# EAGLE design MOwlEye (EAGLE 7.5.0)
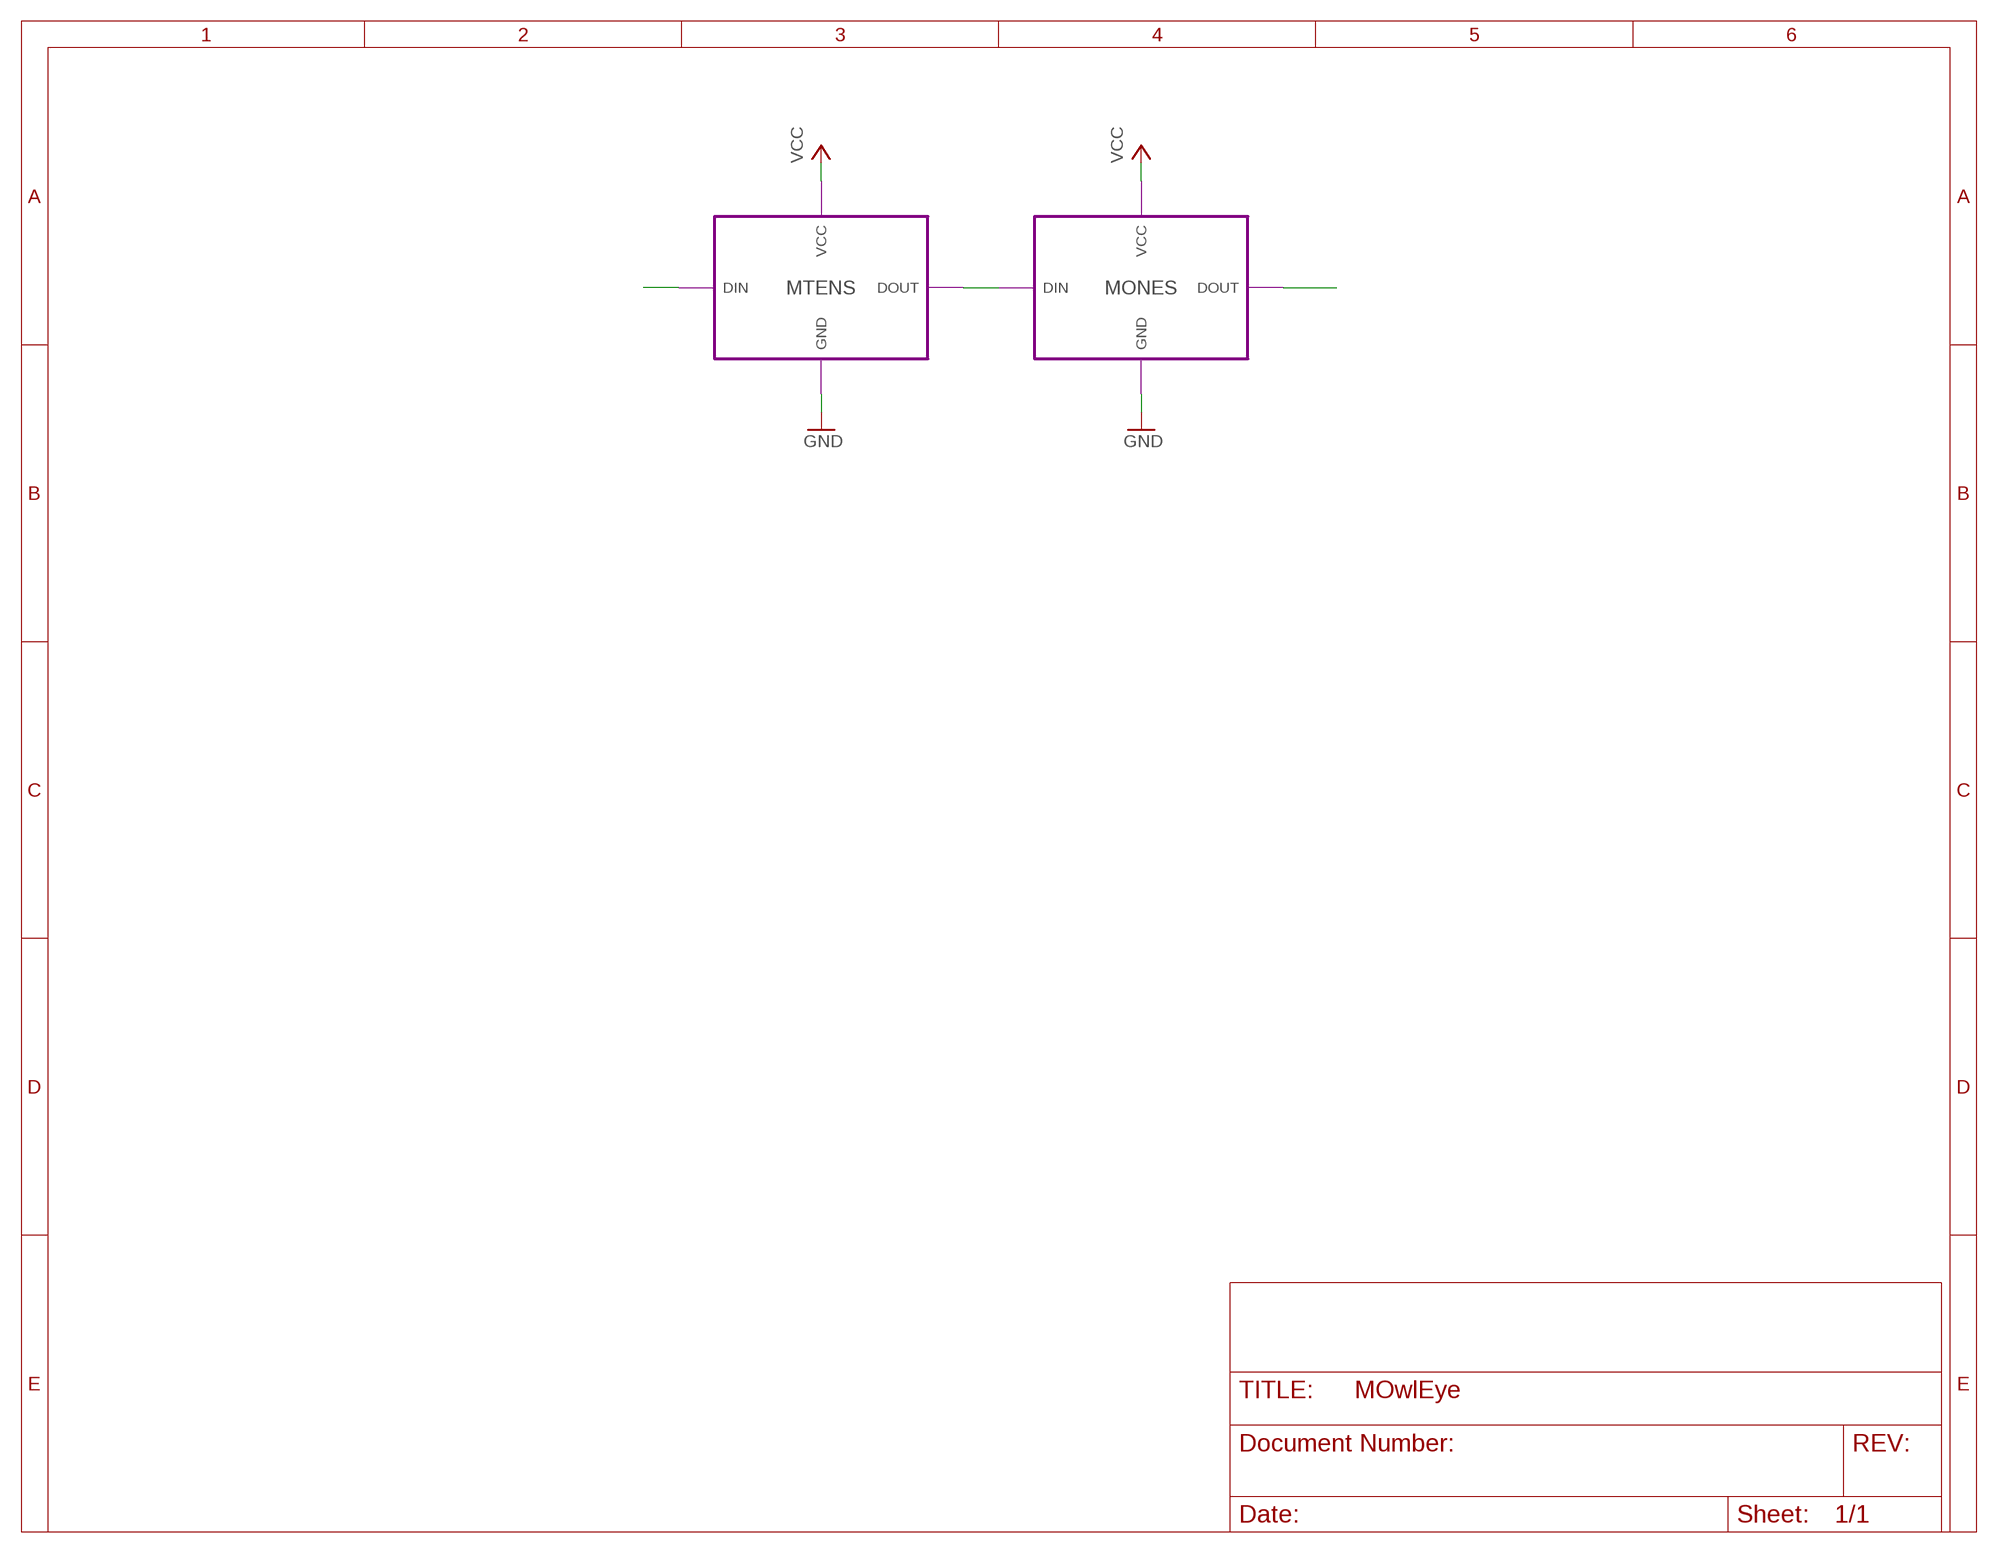
[diagram p0: schematic, sheet 1]

## Module instances
MTENS = LEDS
MONES = LEDS

## Nets
GND: port MTENS.GND MONES.GND
N$1: port MTENS.DOUT MONES.DIN
N$2: port MTENS.DIN
N$3: port MONES.DOUT
VCC: port MTENS.VCC MONES.VCC

## Library data of the parts

## Module LEDS
Ports: GND(pwr) VCC(pwr) DOUT(out) DIN(in)
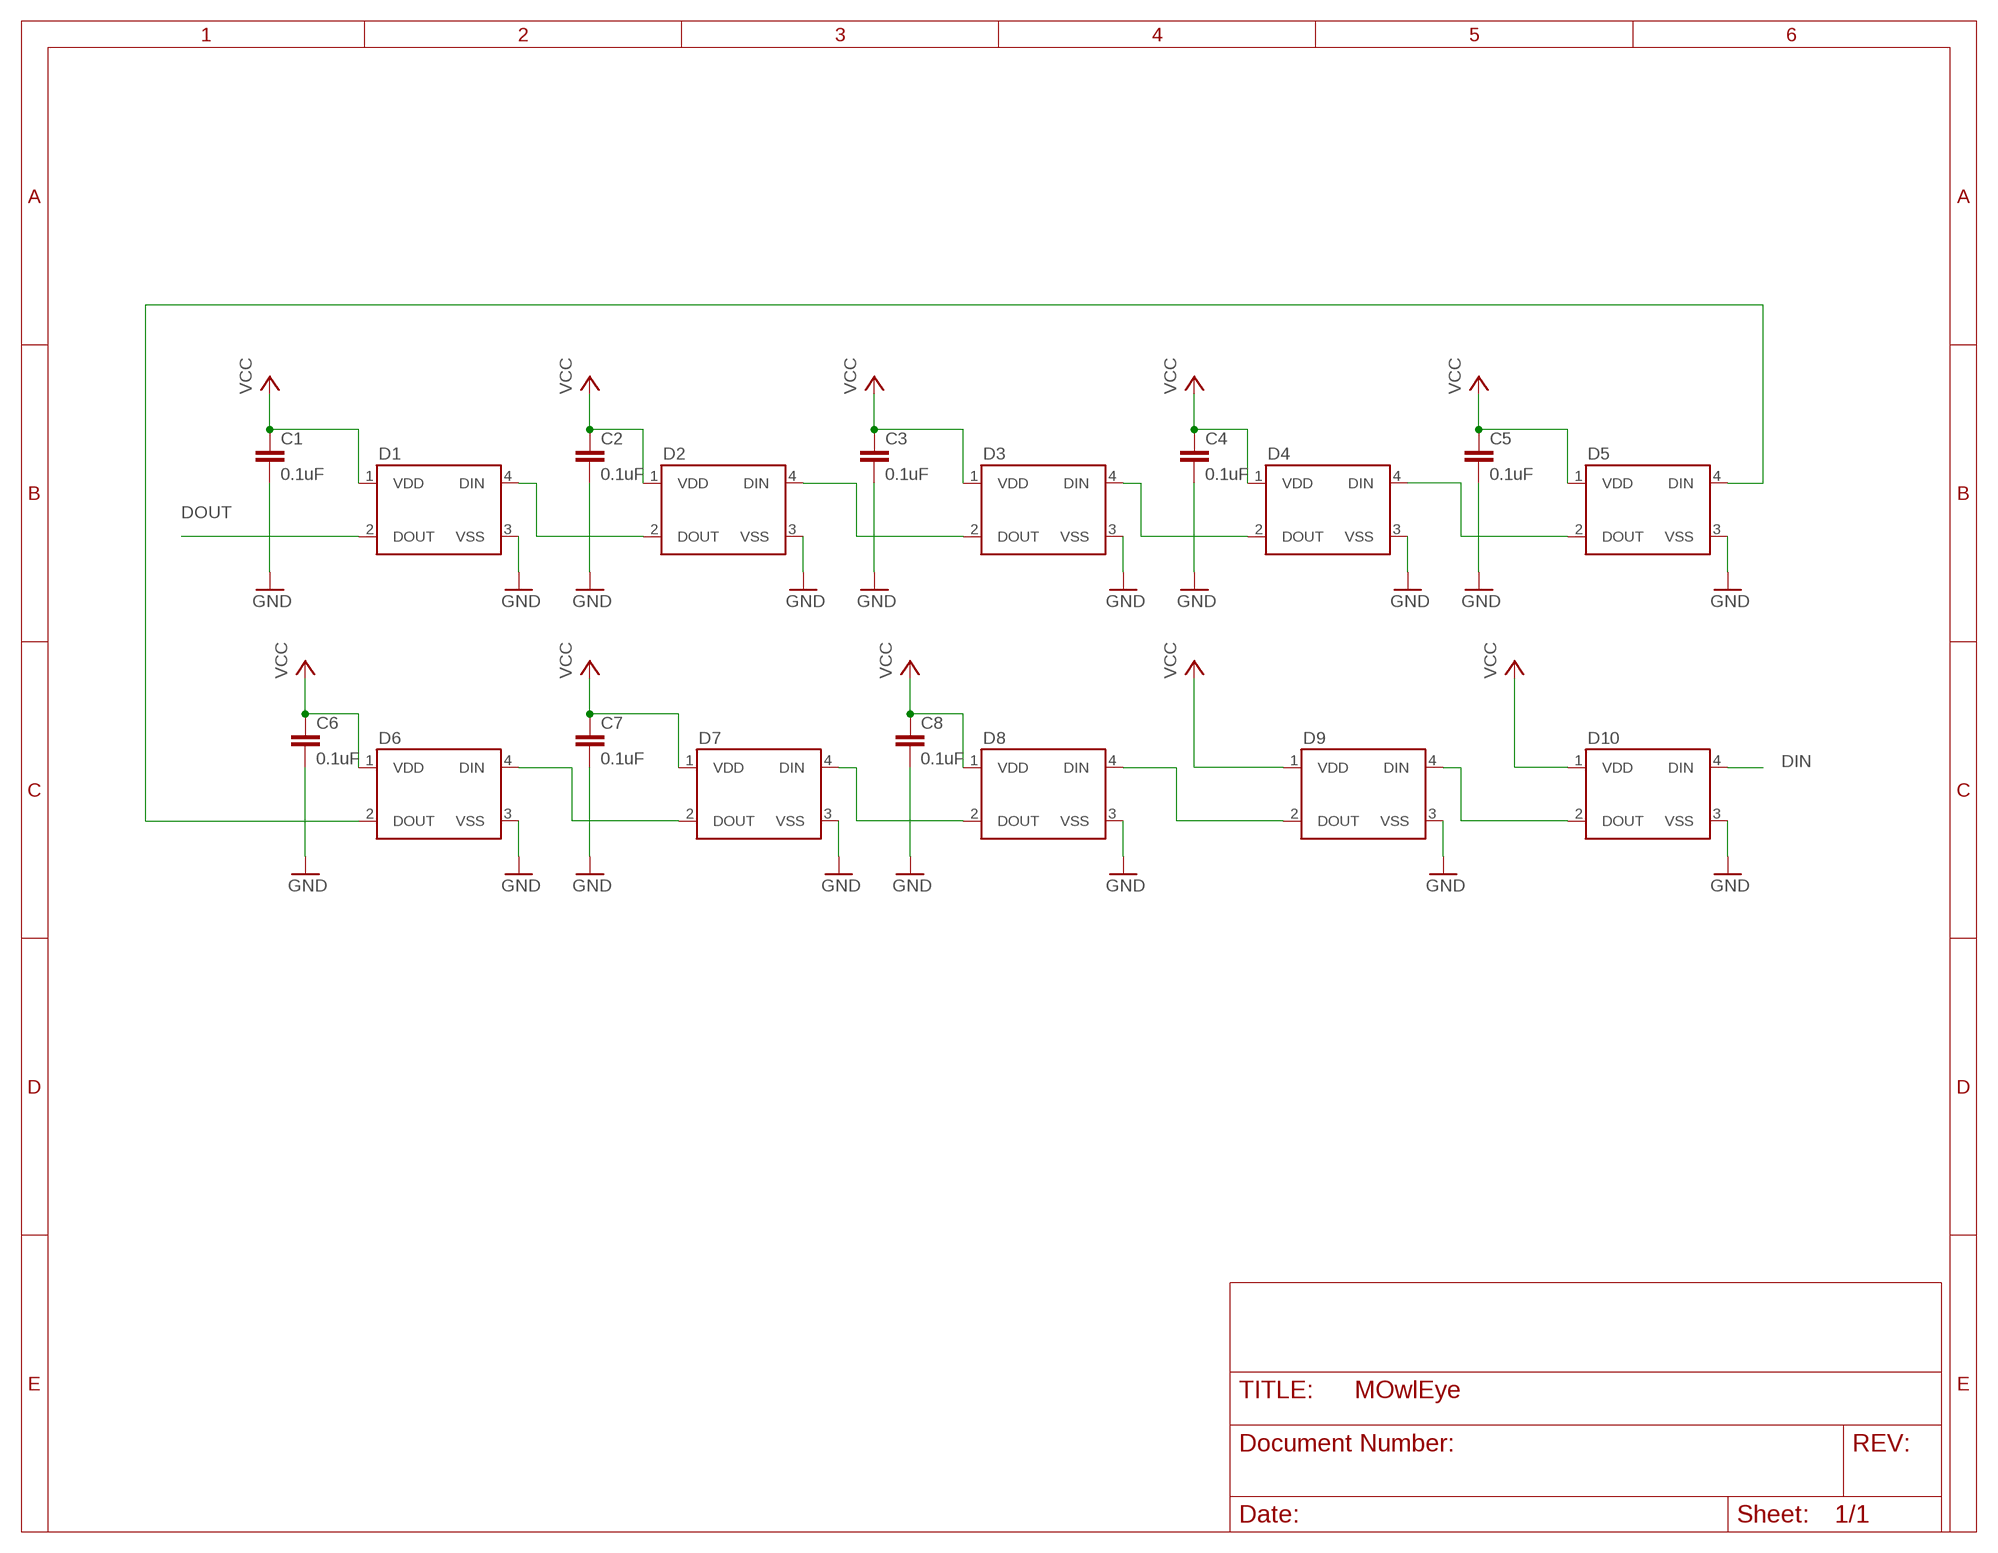
[diagram p1: schematic, module LEDS, sheet 1]

### Parts
C1  0.1uF  0.1UF-25V(+80/-20%)(0603)  [0603-CAP]
C2  0.1uF  0.1UF-25V(+80/-20%)(0603)  [0603-CAP]
C3  0.1uF  0.1UF-25V(+80/-20%)(0603)  [0603-CAP]
C4  0.1uF  0.1UF-25V(+80/-20%)(0603)  [0603-CAP]
C5  0.1uF  0.1UF-25V(+80/-20%)(0603)  [0603-CAP]
C6  0.1uF  0.1UF-25V(+80/-20%)(0603)  [0603-CAP]
C7  0.1uF  0.1UF-25V(+80/-20%)(0603)  [0603-CAP]
C8  0.1uF  0.1UF-25V(+80/-20%)(0603)  [0603-CAP]
D1  WS2812B  [WS2812B]
D2  WS2812B  [WS2812B]
D3  WS2812B  [WS2812B]
D4  WS2812B  [WS2812B]
D5  WS2812B  [WS2812B]
D6  WS2812B  [WS2812B]
D7  WS2812B  [WS2812B]
D8  WS2812B  [WS2812B]
D9  WS2812B  [WS2812B]
D10  WS2812B  [WS2812B]

### Nets
DIN: D10.4(DIN)
DOUT: D1.2(DOUT)
GND: C1.2 C2.2 C3.2 C4.2 C5.2 C6.2 C7.2 C8.2 D1.3(VSS) D2.3(VSS) D3.3(VSS) D4.3(VSS) D5.3(VSS) D6.3(VSS) D7.3(VSS) D8.3(VSS) D9.3(VSS) D10.3(VSS)
N$1: D2.4(DIN) D3.2(DOUT)
N$5: D1.4(DIN) D2.2(DOUT)
N$6: D3.4(DIN) D4.2(DOUT)
N$7: D4.4(DIN) D5.2(DOUT)
N$9: D5.4(DIN) D6.2(DOUT)
N$10: D6.4(DIN) D7.2(DOUT)
N$12: D7.4(DIN) D8.2(DOUT)
N$13: D8.4(DIN) D9.2(DOUT)
N$15: D9.4(DIN) D10.2(DOUT)
VCC: C1.1 C2.1 C3.1 C4.1 C5.1 C6.1 C7.1 C8.1 D1.1(VDD) D2.1(VDD) D3.1(VDD) D4.1(VDD) D5.1(VDD) D6.1(VDD) D7.1(VDD) D8.1(VDD) D9.1(VDD) D10.1(VDD)

### Library data of the parts
C1-C8 = SparkFun-Capacitors:0.1UF-25V(+80/-20%)(0603): CAP-00810 Ceramic Standard decoupling cap; PROD_ID: CAP-00810
D1-D10 = SparkFun-LED:WS2812B: WS2812B - Intelligent control LED integrated light source Technical Specifications: Power Supply Voltage (VDD): 3.5 to 5.3 V Input Voltage (VI): -0.5 to VDD+0.5 V Operating Junction Temperature (Topt): -25°C to +80°C Storage Temperature Range (Tstg): -55°C to +150°C

## Board
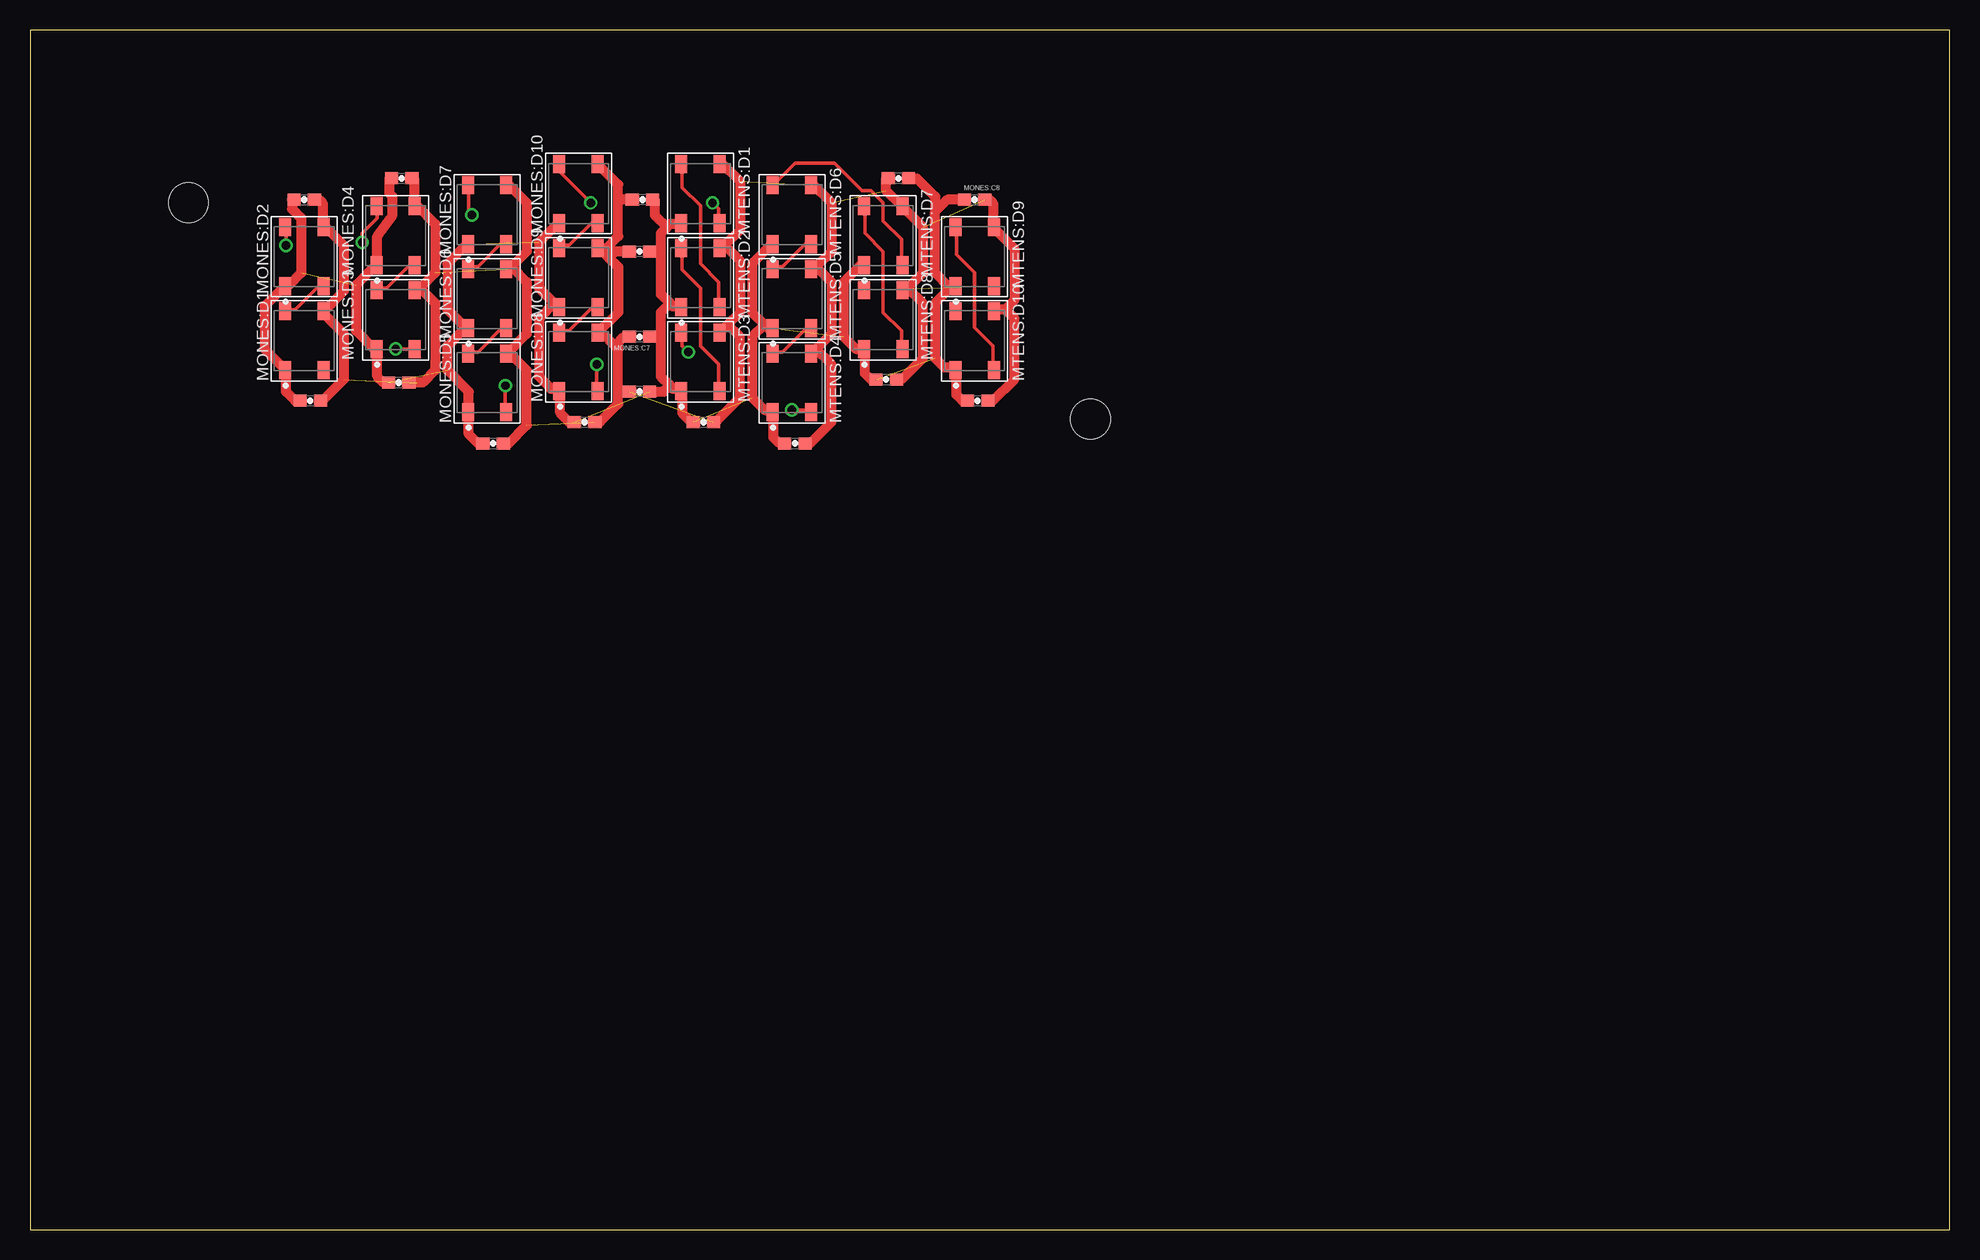
[diagram p2: board, top side]
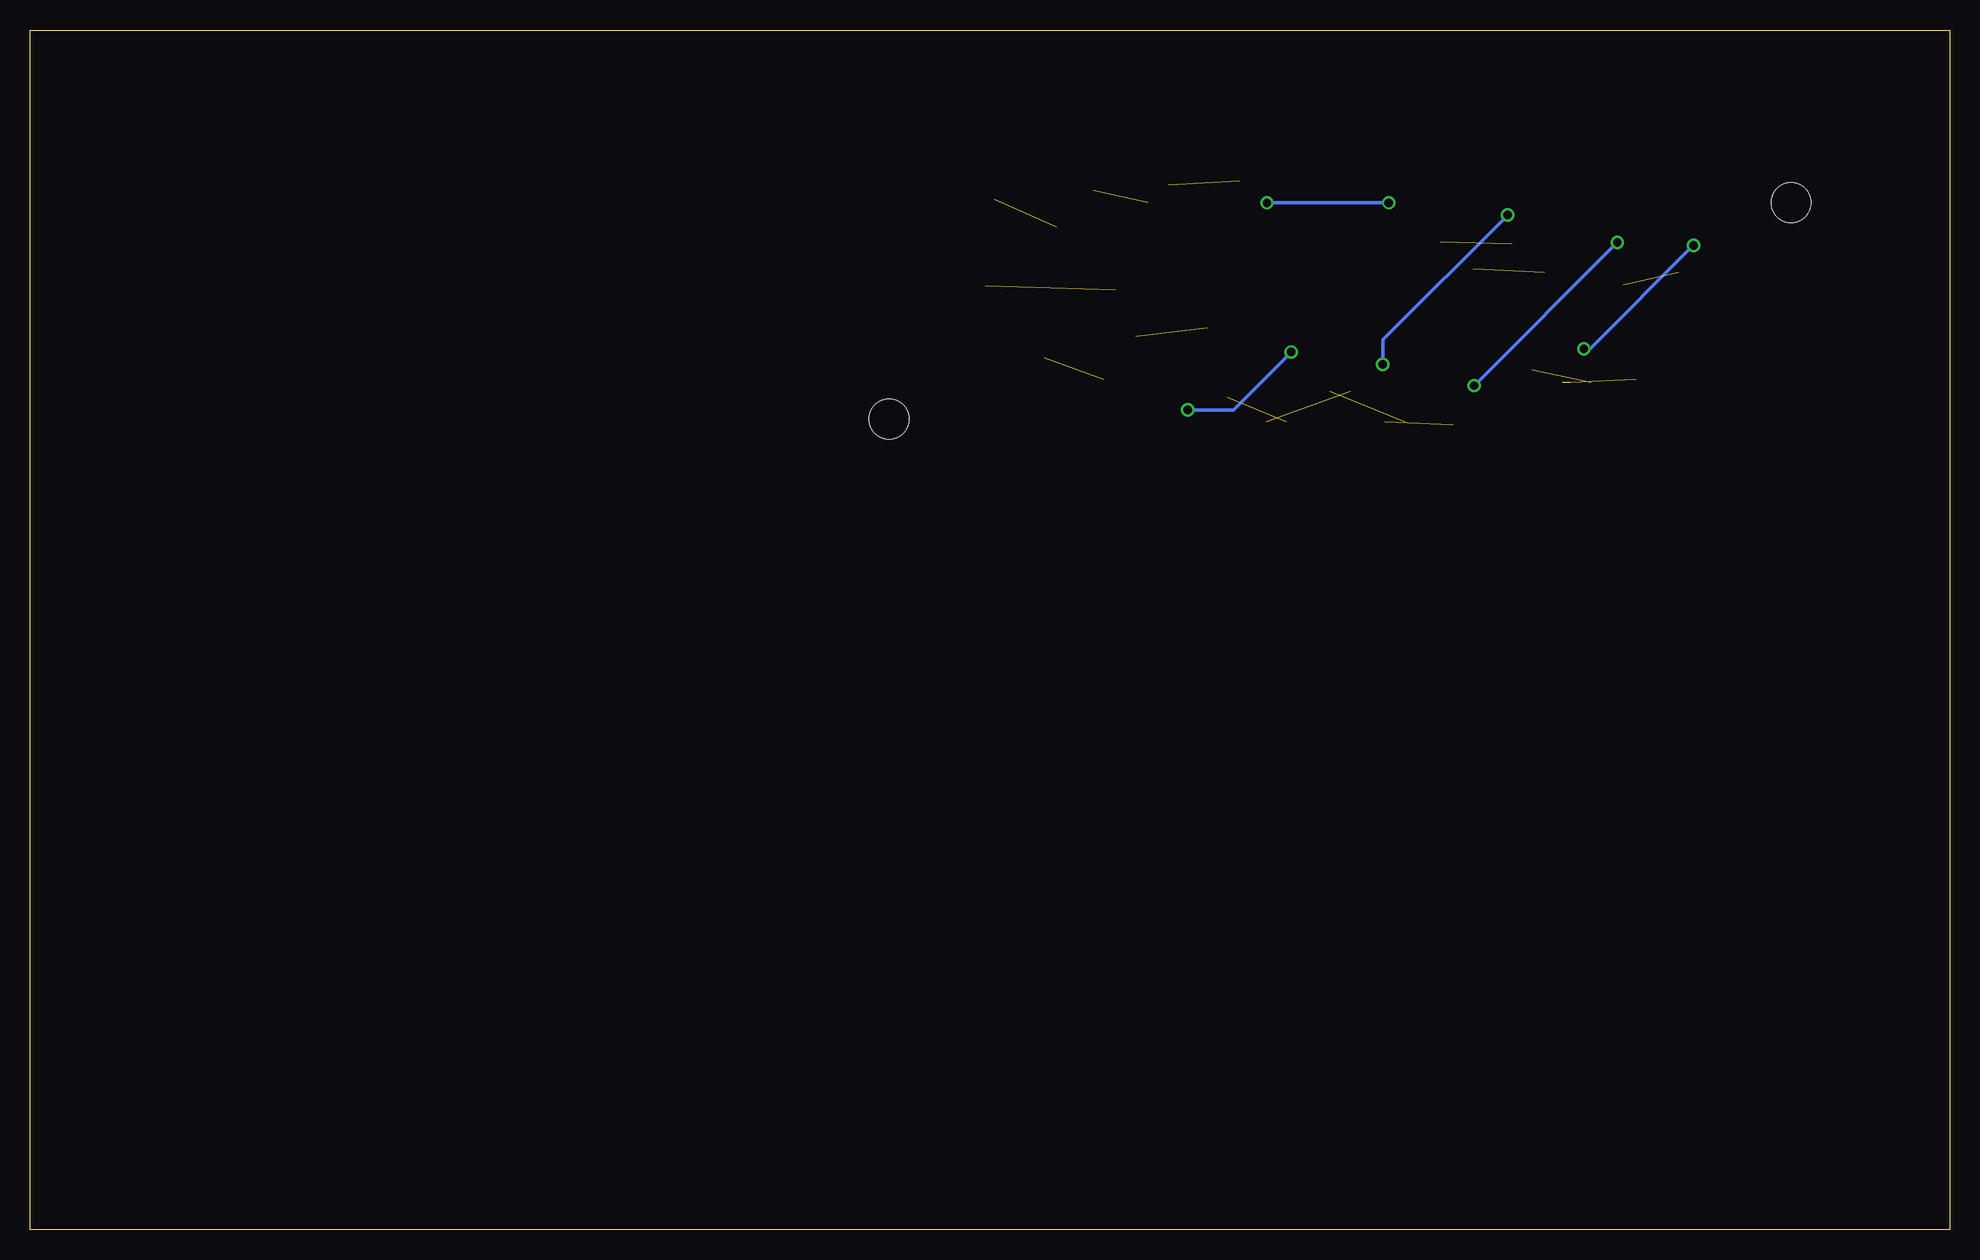
[diagram p3: board, bottom side, seen from below]

Size 160 x 100 mm. Coordinates in mm from the lower left corner, seen from the top.
Outline: 0,0 160,0 160,100 0,100 0,0
Copper layers (1*16): Top 0.035mm / dielectric 1.5mm / Bottom 0.035mm
Design rules "default": minimum track width 10mil, minimum drill 24mil, track to track 8mil, track to pad 8mil, pad to pad 8mil, via to via 8mil, smd to smd 8mil, copper to edge 40mil, drill to drill 8mil, minimum pad ring 10mil, minimum via ring 8mil, stop-mask expansion 4mil, vias tented up to drill 0mil, thermal gap 10mil

### Footprints (pad centres in the part's own frame; a part is rotated, then mirrored left to right if it is on the bottom)
0603-CAP = smd 1.1 x 1: 1 -0.85,0; 2 0.85,0
WS2812B = smd 1.5 x 1: 1 -2.45,1.6; 2 -2.45,-1.6; 3 2.45,-1.6; 4 2.45,1.6
STAND-OFF = hole 3.302: 0,0

### Placement (x,y rotation side)
MONES:C1  0.1uF  [0603-CAP]  23.37,69.09 0 top
MONES:C2  0.1uF  [0603-CAP]  30.73,70.61 0 top
MONES:C3  0.1uF  [0603-CAP]  38.61,65.53 0 top
MONES:C4  0.1uF  [0603-CAP]  46.23,67.31 0 top
MONES:C5  0.1uF  [0603-CAP]  22.86,85.85 0 top
MONES:C6  0.1uF  [0603-CAP]  30.99,87.63 0 top
MONES:C7  0.1uF  [0603-CAP]  50.8,74.42 180 top
MONES:C8  0.1uF  [0603-CAP]  78.74,85.85 0 top
MONES:D1  [WS2812B]  22.86,74.09 90 top
MONES:D2  [WS2812B]  22.86,81.1 90 top
MONES:D3  [WS2812B]  30.48,75.84 90 top
MONES:D4  [WS2812B]  30.48,82.85 90 top
MONES:D5  [WS2812B]  38.1,70.59 90 top
MONES:D6  [WS2812B]  38.1,77.6 90 top
MONES:D7  [WS2812B]  38.1,84.61 90 top
MONES:D8  [WS2812B]  45.72,72.34 90 top
MONES:D9  [WS2812B]  45.72,79.35 90 top
MONES:D10  [WS2812B]  45.72,86.36 90 top
MTENS:C1  0.1uF  [0603-CAP]  51.05,85.85 180 top
MTENS:C2  0.1uF  [0603-CAP]  50.8,81.53 180 top
MTENS:C3  0.1uF  [0603-CAP]  50.8,69.85 180 top
MTENS:C4  0.1uF  [0603-CAP]  56.13,67.31 0 top
MTENS:C5  0.1uF  [0603-CAP]  63.75,65.53 0 top
MTENS:C6  0.1uF  [0603-CAP]  71.37,70.87 0 top
MTENS:C7  0.1uF  [0603-CAP]  78.99,69.09 0 top
MTENS:C8  0.1uF  [0603-CAP]  72.39,87.63 180 top
MTENS:D1  [WS2812B]  55.88,86.36 90 top
MTENS:D2  [WS2812B]  55.88,79.35 90 top
MTENS:D3  [WS2812B]  55.88,72.34 90 top
MTENS:D4  [WS2812B]  63.5,70.59 90 top
MTENS:D5  [WS2812B]  63.5,77.6 90 top
MTENS:D6  [WS2812B]  63.5,84.61 90 top
MTENS:D7  [WS2812B]  71.12,82.85 90 top
MTENS:D8  [WS2812B]  71.12,75.84 90 top
MTENS:D9  [WS2812B]  78.74,81.1 90 top
MTENS:D10  [WS2812B]  78.74,74.09 90 top
U$1  [STAND-OFF]  13.21,85.6 0 top
U$2  [STAND-OFF]  88.39,67.56 0 top

### Tracks (layer width: path | path; a pad name or v marks a point on that pad's centre or on a via)
GND  (8 unrouted)
  Top 0.305: 72.64,85.6 MTENS:D7.3
  Top 0.813: 81.28,76.71 80.52,76.71 MTENS:D10.3 | 81.28,76.71 82.04,77.47 82.04,81.79 80.52,83.31 MTENS:D9.3 80.26,83.82 80.26,85.6 80.01,85.85 MONES:C8.2 | 73.15,78.49 72.9,78.49 MTENS:D8.3 | 73.15,78.49 74.42,79.76 74.42,83.57 72.9,85.09 MTENS:D7.3 72.64,85.34 71.37,86.61 71.37,87.63 MTENS:C8.2 | MTENS:D6.3 65.28,87.12 66.8,85.6 66.8,81.53 65.53,80.26 | 65.53,80.26 65.28,80.26 MTENS:D5.3 | 65.53,80.26 66.8,78.99 66.8,74.68 65.53,73.41 | 65.53,73.41 65.28,73.15 MTENS:D4.3 | MTENS:D1.3 57.66,88.9 59.18,87.38 59.18,83.31 57.91,82.04 | 57.91,82.04 57.66,82.04 MTENS:D2.3 | 57.91,82.04 59.18,80.77 59.18,76.45 58.17,75.44 | 58.17,75.44 57.66,74.93 MTENS:D3.3 | MTENS:C6.2 72.64,70.87 74.42,72.64 74.42,77.22 73.15,78.49 | MTENS:C7.2 80.26,69.09 82.04,70.87 82.04,75.95 81.28,76.71 | MTENS:C5.2 65.02,65.53 66.8,67.31 66.8,72.14 65.53,73.41 | MTENS:C4.2 57.15,67.31 59.18,69.34 59.18,74.42 58.17,75.44 | MONES:D10.3 47.5,88.65 49.02,87.12 49.02,85.85 | 47.5,82.04 MONES:D9.3 47.76,81.47 | 48.25,81 49.02,80.26 49.02,76.45 47.5,74.93 MONES:D8.3 47.75,74.68 48.77,73.66 | 48.25,81 47.76,81.47 | 49.02,85.85 49.02,82.8 48.01,81.79 47.76,81.47 | MONES:D7.3 39.88,87.12 41.4,85.6 41.4,81.53 40.13,80.26 | 40.13,80.26 39.88,80.26 MONES:D6.3 | 40.13,80.26 41.4,78.99 41.4,74.68 39.88,73.15 MONES:D5.3 40.13,72.9 41.4,71.63 41.4,67.06 39.88,65.53 MONES:C3.2 | 32.51,78.49 32.26,78.49 MONES:D3.3 | 32.51,78.49 33.78,79.76 33.78,83.82 32.26,85.34 MONES:D4.3 32,85.6 32,87.63 MONES:C6.2 | 32.51,78.49 33.78,77.22 33.78,71.63 32.77,70.61 32.26,70.61 | MONES:C4.2 47.5,67.31 49.02,68.83 49.02,69.85 | 49.02,69.85 49.02,73.41 48.77,73.66
  Top 0.813: MTENS:C1.2 49.02,85.85 | MONES:C5.2 24.13,85.85 24.38,85.6 24.38,83.82 MONES:D2.3 24.64,83.57 26.16,82.04 26.16,78.23 24.64,76.71 MONES:D1.3 24.64,76.2 26.16,74.68 26.16,70.87 24.38,69.09 MONES:C1.2 | MTENS:C3.2 49.02,69.85 | 48.77,73.66 49.53,74.42 MONES:C7.2 | MTENS:C2.2 48.77,81.53 48.51,81.28 48.25,81
MONES:N$1  (via drill 0.7 pad 0.61)
  Top 0.305: v30.48,73.41 32,73.41 MONES:D3.2 | v21.34,82.04 21.34,83.31 MONES:D2.4
  Bottom 0.305: v30.48,73.41 29.97,73.41 v21.34,82.04
MONES:N$5
  Top 0.305: MONES:D1.4 21.34,76.71 22.1,76.71 24.38,78.99 24.64,78.74 MONES:D2.2
MONES:N$6
  Top 0.305: MONES:D3.4 28.96,78.49 29.72,78.49 32,80.77 32.26,80.52 MONES:D4.2
MONES:N$7  (via drill 0.7 pad 0.61)
  Top 0.305: v39.62,70.36 39.62,68.33 MONES:D5.2 | v27.69,82.3 27.69,83.06 28.96,84.33 28.96,85.09 MONES:D4.4
  Bottom 0.305: v27.69,82.3 v39.62,70.36
MONES:N$9
  Top 0.305: MONES:D5.4 36.58,73.15 37.34,73.15 39.62,75.44 39.88,75.18 MONES:D6.2
MONES:N$10
  Top 0.305: MONES:D6.4 36.58,80.26 37.34,80.26 39.62,82.55 39.88,82.3 MONES:D7.2
MONES:N$12  (via drill 0.7 pad 0.61)
  Top 0.305: v47.24,72.14 47.24,70.1 MONES:D8.2 | v36.83,84.58 36.58,84.84 36.58,86.87 MONES:D7.4
  Bottom 0.305: v47.24,72.14 47.24,74.17 v36.83,84.58
MONES:N$13
  Top 0.305: MONES:D8.4 44.2,74.93 44.96,74.93 47.24,77.22 47.5,76.96 MONES:D9.2
MONES:N$15
  Top 0.305: MONES:D9.4 44.2,82.04 44.96,82.04 47.24,84.33 47.5,84.07 MONES:D10.2
MTENS:N$1
  Top 0.305: MTENS:D3.2 57.4,70.1 57.4,72.14 55.88,73.66 55.88,78.49 54.36,80.01 54.36,81.79 MTENS:D2.4
MTENS:N$5
  Top 0.305: MTENS:D2.2 57.4,76.96 57.4,78.99 55.88,80.52 55.88,85.34 54.36,86.87 54.36,88.65 MTENS:D1.4
MTENS:N$6  (via drill 0.7 pad 0.61)
  Top 0.305: v63.5,68.33 65.02,68.33 MTENS:D4.2 | v54.86,73.15 54.36,73.66 54.36,74.68 MTENS:D3.4
  Bottom 0.305: v63.5,68.33 59.69,68.33 v54.86,73.15
MTENS:N$7
  Top 0.305: MTENS:D4.4 61.98,73.15 62.74,73.15 65.02,75.44 65.28,75.18 MTENS:D5.2
MTENS:N$9
  Top 0.305: MTENS:D5.4 61.98,80.26 62.74,80.26 65.02,82.55 65.28,82.3 MTENS:D6.2
MTENS:N$10
  Top 0.305: MTENS:D7.2 72.64,80.52 72.64,82.55 71.12,84.07 71.12,85.6 70.1,86.61 69.34,86.61 67.06,88.9 63.75,88.9 61.98,87.12 MTENS:D6.4
MTENS:N$12
  Top 0.305: MTENS:D8.2 72.64,73.41 72.64,74.93 71.12,76.45 71.12,81.53 69.6,83.06 69.6,85.09 MTENS:D7.4
MTENS:N$13  (1 unrouted)
MTENS:N$15
  Top 0.305: MTENS:D10.2 80.26,71.88 80.26,73.66 78.74,75.18 78.74,79.76 77.22,81.28 77.22,83.31 MTENS:D9.4
N$1  (via drill 0.7 pad 0.61)
  Top 0.305: v56.9,85.6 57.4,85.09 57.4,84.07 MTENS:D1.2 | v46.74,85.6 44.2,88.14 44.2,88.65 MONES:D10.4
  Bottom 0.305: v46.74,85.6 v56.9,85.6
VCC  (7 unrouted)
  Top 0.305: 52.07,85.85 52.32,85.85
  Top 0.813: 76.71,78.49 76.96,78.74 MTENS:D9.1 | 76.71,78.49 75.44,77.22 75.44,72.64 76.2,71.88 76.96,71.88 MTENS:D10.1 77.22,71.37 77.22,69.6 77.72,69.09 MTENS:C7.1 | 53.09,83.57 53.34,83.82 54.1,83.82 MTENS:D1.1 | 53.09,83.57 52.58,83.06 52.58,81.53 | 52.58,81.53 52.58,77.98 53.34,77.22 | 53.34,77.22 53.59,76.96 54.1,76.96 MTENS:D2.1 | 53.34,77.22 52.58,76.45 52.58,74.42 | 52.58,74.42 52.58,71.12 53.34,70.36 | 53.34,70.36 53.59,70.1 54.1,70.1 MTENS:D3.1 54.36,69.6 54.36,68.07 55.12,67.31 MTENS:C4.1 | 76.71,78.49 75.44,79.76 75.44,84.84 | MTENS:D6.1 61.72,82.04 60.2,80.52 60.2,76.45 61.21,75.44 | 61.21,75.44 61.72,74.93 MTENS:D5.1 | 61.21,75.44 60.2,74.42 60.2,69.34 61.21,68.33 61.72,68.33 MTENS:D4.1 61.98,67.82 61.98,66.04 62.48,65.53 MTENS:C5.1 | MTENS:D7.1 69.34,80.52 67.82,78.99 67.82,74.42 68.83,73.41 69.34,73.41 MTENS:D8.1 69.6,73.15 69.6,71.37 70.1,70.87 MTENS:C6.1 | MTENS:C8.1 73.91,87.63 75.44,86.11 75.44,84.84 | 75.44,84.84 76.45,85.85 MONES:C8.1 | MONES:D10.1 43.94,83.82 42.42,82.3 42.42,78.49 43.69,77.22 | 43.69,77.22 43.94,76.96 MONES:D9.1 | 43.69,77.22 42.42,75.95 42.42,71.12 43.43,70.1 43.94,70.1 MONES:D8.1 44.2,69.6 44.2,68.07 44.96,67.31 MONES:C4.1 | MONES:D7.1 36.32,82.04 34.8,80.52 34.8,76.71 36.32,75.18 MONES:D6.1 36.07,74.93 34.8,73.66 34.8,71.63 36.58,69.85 36.58,68.33 MONES:D5.1 36.58,68.07 36.58,66.29 37.34,65.53 MONES:C3.1 | MONES:C2.1 29.46,70.61 28.96,71.12 28.96,73.15 MONES:D3.1 28.7,73.41 27.18,74.93 27.18,78.74 28.7,80.26 MONES:D4.1 28.96,80.77 28.96,82.8 30.23,84.58 30.23,86.11 29.97,86.36 29.97,87.63 MONES:C6.1 | MONES:C1.1 22.1,69.09 21.34,69.85 21.34,71.37 MONES:D1.1 21.08,71.88 19.56,73.41 19.56,76.96 21.08,78.49 MONES:D2.1 21.59,78.74 22.61,79.76 22.61,84.33 21.84,85.09 21.84,85.85 MONES:C5.1
  Top 0.813: MTENS:C1.1 52.07,85.85 52.07,84.58 53.09,83.57 | MTENS:C3.1 52.83,69.85 53.34,70.36 | MONES:C7.1 52.58,74.42 | MTENS:C2.1 52.58,81.53